# Altium schematic sheet Sheet1.SchDoc
size A; PageSetup: Record=PageOptions|CenterHorizontal=True|CenterVertical=True|PrintScale=1.00|XCorrection=1.00|YCorrection=1.00|PrintKind=1|BorderSize=5000000|LeftOffset=0|BottomOffset=0|Orientation=2|PaperLength=1000|PaperWidth=1000|Scale=100|PaperSource=7|PrintQuality=-4|MediaType=1|DitherType=10|PaperKind=Letter|PrintScaleMode=0
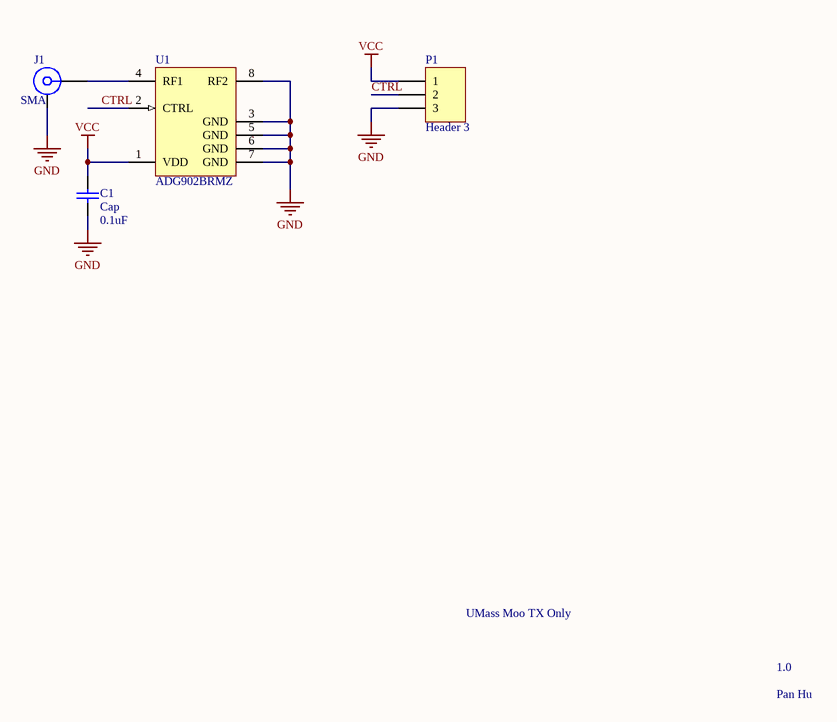
[diagram p0: Sheet1.SchDoc]

## Parts
C1  Cap  value 0.1uF  [1608[0603]]
J1  SMA  [ROS-32K101-400L5_V]
P1  Header 3  [HDR1X3]
U1  ADG902BRMZ  [ADI-RM-8_M]

## Nets
GND: C1.1 J1.MH P1.3 U1.3(GND) U1.5(GND) U1.6(GND) U1.7(GND) U1.8(RF2)
VCC: C1.2 P1.1 U1.1(VDD)
CTRL: P1.2 U1.2(CTRL)
NetJ1_1: J1.1 U1.4(RF1)

## Notes on the sheet
- UMass Moo TX Only
- 1.0
- Pan Hu

## Library data of the parts
C1 = Cap: Capacitor; Published: 8-Jun-2000; LatestRevisionDate: 17-Jul-2002; LatestRevisionNote: Re-released for DXP Platform.; PackageReference: RAD-0.3; Publisher: Altium Limited; PackageDescription: Radial Cap, Thru-Hole; 2 Leads; 0.3 in Pin Spacing
J1 = CMP-0751-00001-1: SMA Straight Jack, Up to 18 GHz, -55 to 155 degC; PartNumber: 32K101-400L5; Manufacturer: Rosenberger; Design Note: Footprint in library is a generic example - only application specific footprint delivers High Performance; PackageDescription: SMA Straight Jack, 6.35 x 6.35 x 9.5 mm; ComponentLink5URL: http://www.rosenberger.com/en/contact/sales/; DatasheetVersion: a00; ComponentLink3URL: http://rosenberger.de/ok/images/documents/db/32K101-400L5.pdf; ComponentLink4Description: Series Overview / Design Note; ComponentLink5Description: Webshop / RFQ; PackageReference: 32K101-400L5; ComponentLink2Description: Datasheet; PackageVersion: a00; ComponentLink1Description: Manufacturer URL; ComponentLink3Description: Package Specification; ComponentLink2URL: http://rosenberger.de/ok/images/documents/db/32K101-400L5.pdf; Mounting Technology: Through Hole; ComponentLink1URL: http://www.rosenberger.de; ComponentLink4URL: http://rosenberger.de/ok/images/documents/spez/32.pdf
P1 = Header 3: Header, 3-Pin; LatestRevisionDate: 17-Jul-2002; LatestRevisionNote: Re-released for DXP Platform.; Publisher: Altium Limited
U1 = CMP-0290-00055-1: RF Switch, Wideband, 40 dB Isolation at 1 GHz, CMOS 1.65 V to 2.75 V, SPST Switches, RM-8, Pb-Free, 50 Tube; Insertion Loss (dB): 800mdB; Supply Voltage: Single (+1.65V to +2.75V); Configuration: SPST/NO; P-1dB (dBm): 17; Off Isolation Test Freq: 1G; Bandwidth: 4.5GHz; Off Isolation: 37dB; # Sw Functions: 1; PackageReference: RM-8; ComponentLink1Description: Manufacturer URL; PackageVersion: Aug-2005; ComponentLink3Description: Package Specification; ComponentLink2Description: Datasheet; Code_JEDEC: MO-187-AA; PackageDescription: 8-Lead Mini Small Outline Package [MSOP]; ComponentLink3URL: http://www.analog.com/static/imported-files/packages/PKG_PDF/MSOP%28RM%29/RM_8.pdf; DatasheetVersion: RevB; ComponentLink2URL: http://www.analog.com/static/imported-files/data_sheets/ADG901_902.pdf; ComponentLink1URL: www.analog.com